# Altium schematic sheet RMS.SchDoc
size A3; SheetNumber: 1; SheetTotal: 1
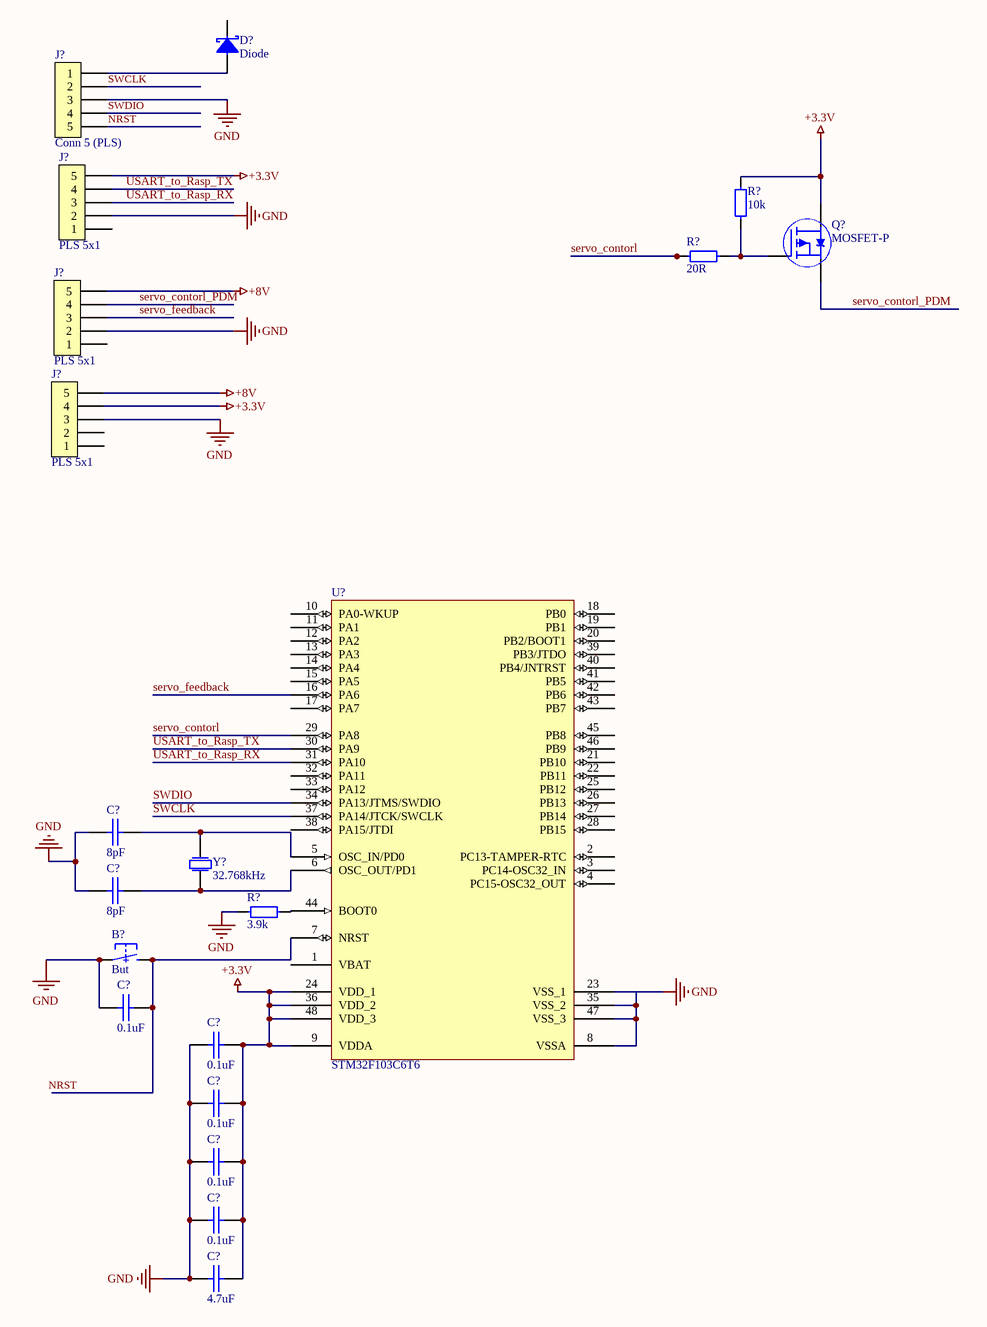
[diagram p0: RMS.SchDoc]

## Parts
(Parts that share a designator on the sheet are numbered #1, #2 ... from top to bottom, then left to right.)
B?  But  [BUTTON 6x3.5]
C?#1  8pF  [0805 Capicator]
C?#2  8pF  [0805 Capicator]
C?#3  0.1uF  [0603 Capicator]
C?#4  0.1uF  [0805 Capicator]
C?#5  0.1uF  [0805 Capicator]
C?#6  0.1uF  [0805 Capicator]
C?#7  0.1uF  [0805 Capicator]
C?#8  4.7uF  [0805 Capicator]
D?  Diode  [sod-123]
J?#1  Conn 5 (PLS)  [PLS 5x1]
J?#2  PLS 5x1  [PLS 5x1]
J?#3  PLS 5x1  [PLS 5x1]
J?#4  PLS 5x1  [PLS 5x1]
Q?  MOSFET-P  [SOT-23]
R?#1  10k  [0805 Resistor]
R?#2  20R  [0805 Resistor]
R?#3  3.9k  [0805 Resistor]
U?  STM32F103C6T6  [LQFP48_N]
Y?  32.768kHz  [Crystal ABM]

## Nets
+3.3V: C?#4.2 C?#5.2 C?#6.2 C?#7.2 C?#8.2 J?#2.5 J?#4.4 Q?.3(Drain) R?#1.2 U?.9(VDDA) U?.24(VDD_1) U?.36(VDD_2) U?.48(VDD_3)
+8V: J?#3.5 J?#4.5
GND: B?.1 C?#1.1 C?#2.1 C?#3.1 C?#4.1 C?#5.1 C?#6.1 C?#7.1 C?#8.1 J?#1.3 J?#2.2 J?#3.2 J?#4.3 R?#3.1 U?.8(VSSA) U?.23(VSS_1) U?.35(VSS_2) U?.47(VSS_3)
NRST: B?.2 C?#3.2 J?#1.5
servo_contorl: R?#2.1 U?.29(PA8)
servo_contorl_PDM: J?#3.4 Q?.2(Source)
servo_feedback: J?#3.3 U?.16(PA6)
SWCLK: J?#1.2 U?.37(PA14/JTCK/SWCLK)
SWDIO: J?#1.4 U?.34(PA13/JTMS/SWDIO)
USART_to_Rasp_RX: J?#2.3 U?.31(PA10)
USART_to_Rasp_TX: J?#2.4 U?.30(PA9)
NetC?#1_2: C?#1.2 U?.5(OSC_IN/PD0) Y?.2
NetC?#2_2: C?#2.2 U?.6(OSC_OUT/PD1) Y?.1
NetD?_1: D?.1 J?#1.1
NetQ?_1: Q?.1(Gate) R?#1.1 R?#2.2
NetR?#3_2: R?#3.2 U?.44(BOOT0)

Not connected (* = marked no-connect by the designer): D? 2; J?#2 1; J?#3 1; J?#4 1 2; U? 1(VBAT) 2(PC13-TAMPER-RTC) 3(PC14-OSC32_IN) 4(PC15-OSC32_OUT) 7(NRST) 10(PA0-WKUP) 11(PA1) 12(PA2) 13(PA3) 14(PA4) 15(PA5) 17(PA7) 18(PB0) 19(PB1) 20(PB2/BOOT1) 21(PB10) 22(PB11) 25(PB12) 26(PB13) 27(PB14) 28(PB15) 32(PA11) 33(PA12) 38(PA15/JTDI) 39(PB3/JTDO) 40(PB4/JNTRST) 41(PB5) 42(PB6) 43(PB7) 45(PB8) 46(PB9)

## Library data of the parts
B? = Button 2 Conn: Button 2 Conn SMD; Part Number: L-KLS7-TS3608-5.0-180; Manufacturer: KLS electronic co ltd; Type: Button; ComponentLink1Description: Chip&Dip; ComponentLink1URL: https://www.chipdip.ru/product/kls7-ts3608-5.0-180-td-02xa
C?#1 C?#2 = Cap 8pF (0805)_1: 8pF NPO 50V, 5%, 0805; Manufacturer: Murata Manufacturing; Part Number: MLCC8.0pFNPO50V5%0805; Type: Capacitor; ComponentLink1Description: Chip&Dip; ComponentLink1URL: https://www.chipdip.ru/product0/180505270
C?#3 = Cap 0.1uF (0603): 0.1uF X7R 16V 10% 0603; Manufacturer: Murata Manufacturing; Part Number: GRM188R71C104KA01D; Type: Capacitor; ComponentLink1Description: Chip&Dip; ComponentLink1URL: https://www.chipdip.ru/product/grm188r71c104ka01d
C?#4-C?#7 = Cap 0.1uF (0805): 0.1uF X7R 25V 10% 0805; Manufacturer: Murata Manufacturing; Part Number: GRM21BR71E104KA01L; Type: Capacitor; ComponentLink1Description: Chip&Dip; ComponentLink1URL: https://www.chipdip.ru/product/grm21br71e104ka01l
C?#8 = Cap 4.7uF (0805): 4.7uF X5R 10% 25V 0805; Manufacturer: Murata Manufacturing; Part Number: GRM21BR61E475KA12L; Type: Capacitor; ComponentLink1Description: Chip&Dip; ComponentLink1URL: https://www.chipdip.ru/product/grm21br61e475ka12l
D? = Diode Schottky (SOD-123): 0.5 A, Low Forward Voltage less than 385 mV, 400 mW Power Dissipation Package; Part Number: MBR0520L; Manufacturer: ON Semiconductor; Type: Diode; ComponentLink1Description: DataSheet; ComponentLink1URL: http://www.farnell.com/datasheets/1875336.pdf; ComponentLink2Description: Chip&Dip; ComponentLink2URL: https://www.chipdip.ru/product/mbr0520l
J?#1-J?#4 = Conn 5 (PLS): Header, 5-Pin
Q? = MOSFET-P [IRLML]: P-Channel Power MOSFET 12V to 20V, Infineon; Part Number: IRLML2246TRPBF; Manufacturer: Infineon Technologies; Type: Transistor; ComponentLink1Description: Chip&Dip; ComponentLink1URL: https://www.chipdip.ru/product/irlml2246trpbf; ComponentLink2Description: DataSheet; ComponentLink2URL: http://www.farnell.com/datasheets/1911921.pdf
R?#1 = Res 10k (0805): 0.125W 0805 10k, 1%; Part Number: RC0805FR-0710KL; Manufacturer: Taiwan; Type: Resistor; ComponentLink1Description: Chip&Dip; ComponentLink1URL: https://www.chipdip.ru/product0/9000079514
R?#2 = Res 20R (0805): 0.5W 0805 20R, 1%; Part Numder: CRCW080520R0FKEAHP; Manufacturer: Vishay; Type: Resistor; ComponentLink1Description: DataSheet; ComponentLink1URL: http://www.farnell.com/datasheets/2618455.pdf; ComponentLink2Description: Chip&Dip; ComponentLink2URL: chipdip.ru/product/crcw080520r0fkeahp-1
R?#3 = Res 3.9k (0805): 0.125W 0805 3.9k, 1%; Part Number: RC0805FR-073K9L; Manufacturer: Taiwan; Type: Resistor; ComponentLink1Description: Chip&Dip; ComponentLink1URL: https://www.chipdip.ru/product0/9000079500
U? = STM32F103C6T6: STM32 ARM-based 32-bit MCU with 32 Kbytes Flash, 48-pin LQFP, Industrial Temperature; Published: 30-May-2008; DatasheetVersion: rev6, Mar-2008; PackageVersion: Mar-2008; PackageReference: LQFP48; Publisher: Altium Limited; PackageDescription: 48-Pin Low-Profile Quad Flat Pack, 7 x 7 mm Body, 0.5 mm Pitch (LQFP48); ComponentLink1Description: Manufacturer Link; ComponentLink1URL: www.st.com/stm32; ComponentLink2Description: Datasheet; ComponentLink2URL: http://www.st.com/stonline/products/literature/ds/13587.pdf
Y? = Crystal 32.768kHz: 32.768kHz, SMD, 6 pF; Manufacturer: Seiko; Part Number: 9000417960; Type: Crystal; ComponentLink1Description: Chip&Dip; ComponentLink1URL: https://www.chipdip.ru/product/32.768-khz-smd-8mmx3.8mm-6-pf